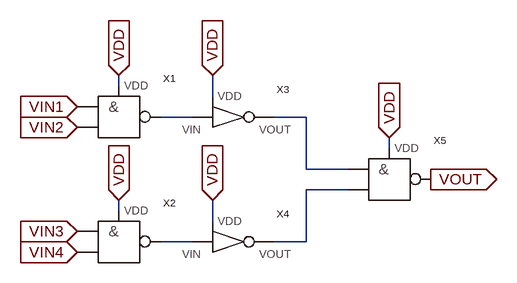
[diagram p0: schematic nand_4.asc]
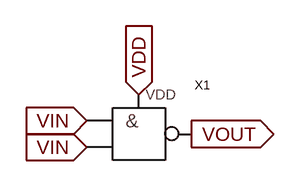
[diagram p1: sub-circuit inverter_2.asc]
nand_4.asc, the LTspice schematic file:
Version 4
SHEET 1 1884 788
WIRE 544 224 544 208
WIRE 688 240 688 208
WIRE 656 272 608 272
WIRE 832 272 784 272
WIRE 960 320 960 304
WIRE 832 352 832 272
WIRE 896 352 832 352
WIRE 896 384 832 384
WIRE 544 416 544 400
WIRE 688 432 688 400
WIRE 656 464 608 464
WIRE 832 464 832 384
WIRE 832 464 784 464
FLAG 480 256 VIN1
IOPIN 480 256 In
FLAG 480 288 VIN2
IOPIN 480 288 In
FLAG 544 208 VDD
IOPIN 544 208 In
FLAG 688 208 VDD
IOPIN 688 208 In
FLAG 480 448 VIN3
IOPIN 480 448 In
FLAG 480 480 VIN4
IOPIN 480 480 In
FLAG 544 400 VDD
IOPIN 544 400 In
FLAG 688 400 VDD
IOPIN 688 400 In
FLAG 960 304 VDD
IOPIN 960 304 In
FLAG 1024 368 VOUT
IOPIN 1024 368 Out
SYMBOL nand_2 544 272 R0
SYMATTR InstName X1
SYMBOL inverter_2 640 272 R0
SYMATTR InstName X3
SYMBOL nand_2 544 464 R0
SYMATTR InstName X2
SYMBOL inverter_2 640 464 R0
SYMATTR InstName X4
SYMBOL nand_2 960 368 R0
SYMATTR InstName X5

inverter_2.asc, the sub-circuit schematic file:
Version 4
SHEET 1 880 680
FLAG 16 48 VIN
IOPIN 16 48 In
FLAG 16 80 VIN
IOPIN 16 80 In
FLAG 80 16 VDD
IOPIN 80 16 In
FLAG 144 64 VOUT
IOPIN 144 64 Out
SYMBOL nand_2 80 64 R0
SYMATTR InstName X1

The netlist it stands for:
* nand_4.asc
XX1 VIN1 VIN2 VDD N001 nand_2  ; pins VIN1 VIN2 VDD VOUT
XX3 N001 VDD N002 inverter_2
XX2 VIN3 VIN4 VDD N004 nand_2  ; pins VIN1 VIN2 VDD VOUT
XX4 N004 VDD N003 inverter_2
XX5 N002 N003 VDD VOUT nand_2  ; pins VIN1 VIN2 VDD VOUT

* block symbol definitions
.subckt inverter_2 VIN VDD VOUT
XX1 VIN VIN VDD VOUT nand_2  ; pins VIN1 VIN2 VDD VOUT
.ends inverter_2

.backanno
.end